# EAGLE design PetitCool_InternalShield (EAGLE 7.3.0)
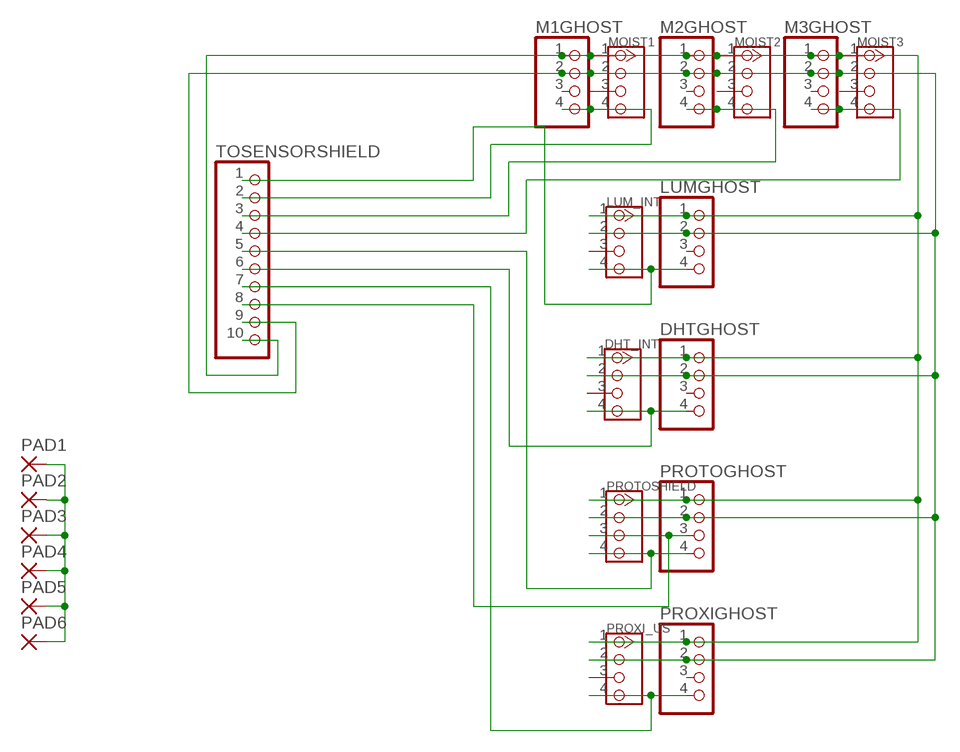
[diagram p0: schematic, sheet 1]

## Parts
DHT_INT  TWIG-4P-2.0-2.0  [4P-2.0]
DHTGHOST  PINHD-1X4  [1X04]
LUM_INT  TWIG-4P-2.0-2.0  [4P-2.0]
LUMGHOST  PINHD-1X4  [1X04]
M1GHOST  PINHD-1X4  [1X04]
M2GHOST  PINHD-1X4  [1X04]
M3GHOST  PINHD-1X4  [1X04]
MOIST1  TWIG-4P-2.0-2.0  [4P-2.0]
MOIST2  TWIG-4P-2.0-2.0  [4P-2.0]
MOIST3  TWIG-4P-2.0-2.0  [4P-2.0]
PAD1  2,15/1,0  [2,15/1,0]
PAD2  2,15/1,0  [2,15/1,0]
PAD3  2,15/1,0  [2,15/1,0]
PAD4  2,15/1,0  [2,15/1,0]
PAD5  2,15/1,0  [2,15/1,0]
PAD6  2,15/1,0  [2,15/1,0]
PROTOGHOST  PINHD-1X4  [1X04]
PROTOSHIELD  TWIG-4P-2.0-2.0  [4P-2.0]
PROXI_US  TWIG-4P-2.0-2.0  [4P-2.0]
PROXIGHOST  PINHD-1X4  [1X04]
TOSENSORSHIELD  PINHD-1X10  [1X10]

## Nets
+5V: DHT_INT.2 DHTGHOST.2 LUM_INT.2 LUMGHOST.2 M1GHOST.2 M2GHOST.2 M3GHOST.2 MOIST1.2 MOIST2.2 MOIST3.2 PROTOGHOST.2 PROTOSHIELD.2 PROXI_US.2 PROXIGHOST.2 TOSENSORSHIELD.9
DHT_INT(D36): DHT_INT.4 DHTGHOST.4 TOSENSORSHIELD.6
GND_5V: DHT_INT.1 DHTGHOST.1 LUM_INT.1 LUMGHOST.1 M1GHOST.1 M2GHOST.1 M3GHOST.1 MOIST1.1 MOIST2.1 MOIST3.1 PAD1.1(P) PAD2.1(P) PAD3.1(P) PAD4.1(P) PAD5.1(P) PAD6.1(P) PROTOGHOST.1 PROTOSHIELD.1 PROXI_US.1 PROXIGHOST.1 TOSENSORSHIELD.10
LUM_INT(A10): LUM_INT.4 LUMGHOST.4 TOSENSORSHIELD.1
MOIST1(A11): M1GHOST.4 MOIST1.4 TOSENSORSHIELD.2
MOIST2(A12): M2GHOST.4 MOIST2.4 TOSENSORSHIELD.3
MOIST3(A13): M3GHOST.4 MOIST3.4 TOSENSORSHIELD.4
PROTO(A14): PROTOGHOST.4 PROTOSHIELD.4 TOSENSORSHIELD.5
PROTO(D44): PROTOGHOST.3 PROTOSHIELD.3 TOSENSORSHIELD.8
PROXI_US(D38): PROXI_US.4 PROXIGHOST.4 TOSENSORSHIELD.7
Unconnected: DHT_INT.3 DHTGHOST.3 LUM_INT.3 LUMGHOST.3 M1GHOST.3 M2GHOST.3 M3GHOST.3 MOIST1.3 MOIST2.3 MOIST3.3 PROXI_US.3 PROXIGHOST.3

## Library data of the parts
DHT_INT LUM_INT MOIST1-MOIST3 PROTOSHIELD PROXI_US = Connector:TWIG-4P-2.0
DHTGHOST LUMGHOST M1GHOST M2GHOST M3GHOST PROTOGHOST PROXIGHOST = pinhead:PINHD-1X4: PIN HEADER
PAD1-PAD6 = wirepad:2,15/1,0: THROUGH-HOLE PAD
TOSENSORSHIELD = pinhead:PINHD-1X10: PIN HEADER

## Board
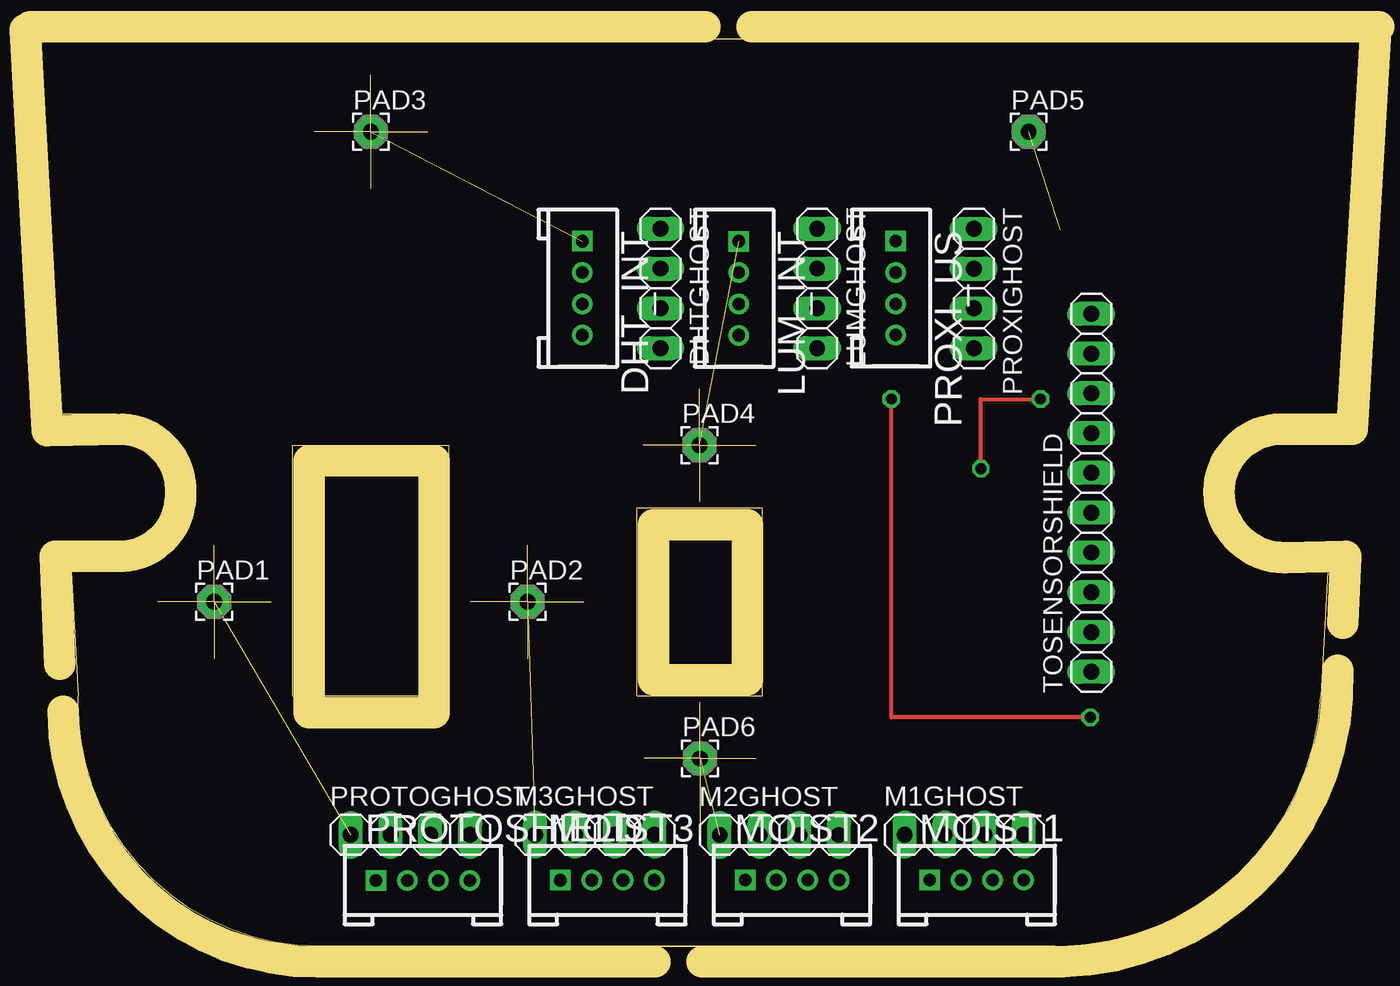
[diagram p1: board, top side]
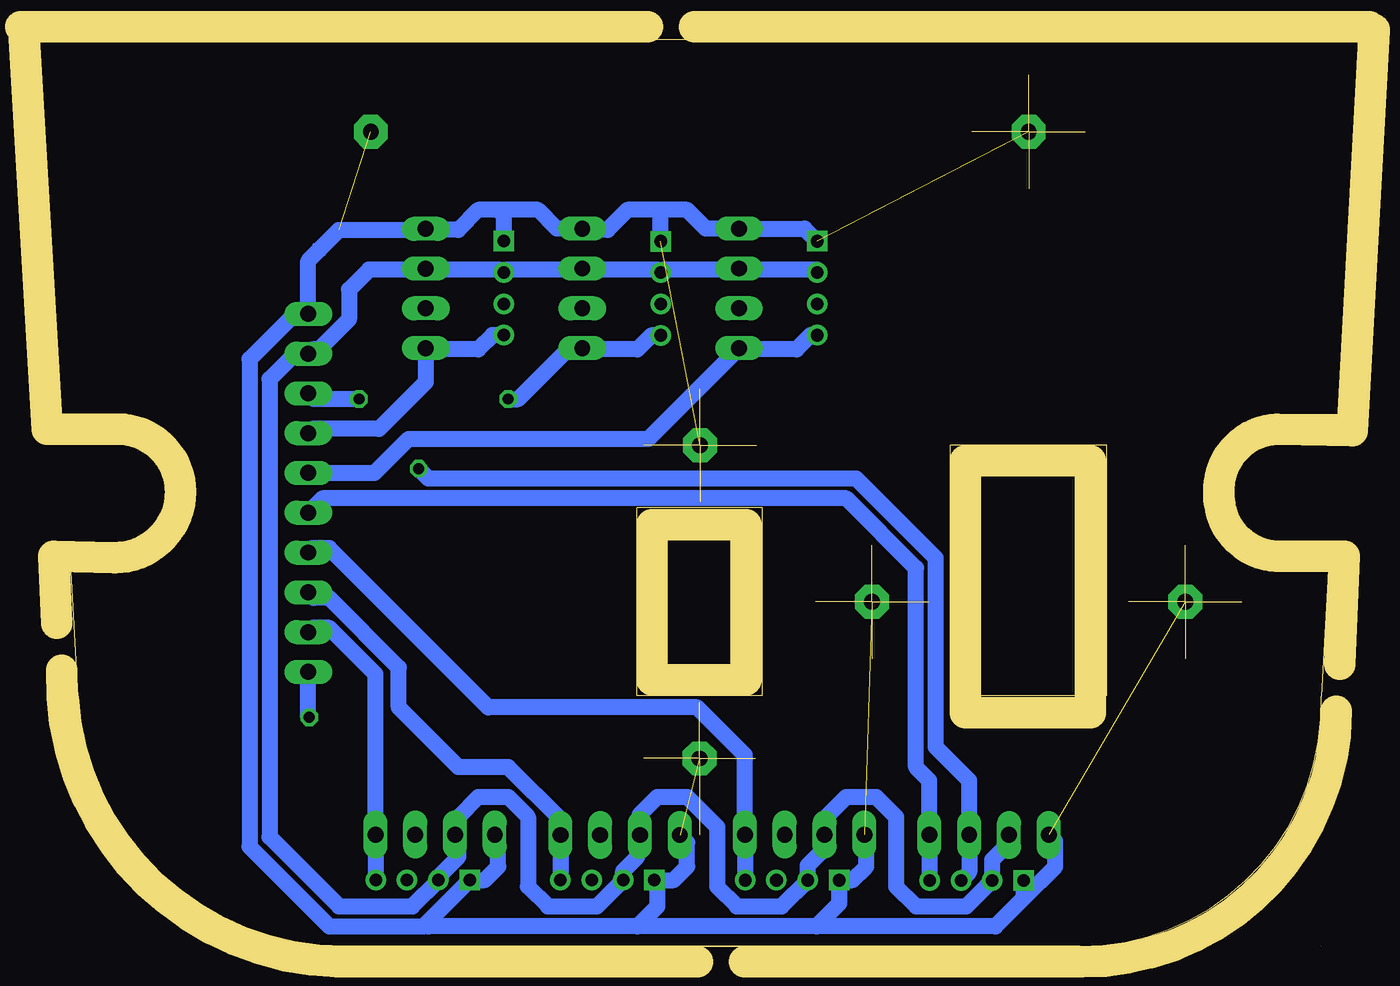
[diagram p2: board, bottom side, seen from below]

Size 84.35 x 57.91 mm. Coordinates in mm from the lower left corner, seen from the top.
Outline: 4.95,23.96 arc180 4.95,33.96
Outline: 79.4,33.96 arc180 79.4,23.96 82.32,23.96 81.85,15.99
Outline: 2.51,0 2.51,0
Outline: 2.51,15.99 arc92 17.91,0.01 64.86,0 19.5,0
Outline: 17.9,0.01 64.86,0 arc87 81.84,15.99
Outline: 2.51,15.99 2.03,23.96 4.95,23.96
Outline: 4.95,33.96 1.43,33.96 0,57.91 84.36,57.91 82.92,33.96 79.4,33.96
Outline: 11.18,22 11.18,25.63
Outline: 11.18,22 7.55,22
Outline: 11.18,22 11.18,18.38
Outline: 11.18,22 14.8,22
Outline: 31.18,22 31.18,25.63
Outline: 31.18,22 27.55,22
Outline: 31.18,22 31.18,18.38
Outline: 31.18,22 34.8,22
Outline: 42.17,32 42.17,35.6
Outline: 42.17,32 38.57,32
Outline: 42.17,32 42.17,28.4
Outline: 42.17,32 45.77,32
Outline: 42.19,12 42.19,15.58
Outline: 42.19,12 38.6,12
Outline: 42.19,12 42.19,7.15
Outline: 42.19,12 45.77,12
Outline: 21.18,52 21.18,55.63
Outline: 21.18,52 17.55,52
Outline: 21.18,52 21.18,48.38
Outline: 21.18,52 24.8,52
Outline: 38.18,28 46.18,28 46.18,16 38.18,16 38.18,28
Outline: 16.18,32 26.18,32 26.18,16 16.18,16 16.18,32
Copper layers (1*16): Top 0.035mm / dielectric 1.5mm / Bottom 0.035mm
Design rules "default": minimum track width 10mil, minimum drill 24mil, track to track 8mil, track to pad 8mil, pad to pad 8mil, via to via 8mil, smd to smd 8mil, copper to edge 40mil, drill to drill 8mil, minimum pad ring 10mil, minimum via ring 8mil, stop-mask expansion 4mil, vias tented up to drill 0mil, thermal gap 10mil
Milling: 26 lines

### Footprints (pad centres in the part's own frame; a part is rotated, then mirrored left to right if it is on the bottom)
4P-2.0 = drill 0.8 pad 1.27 square: 1 -3,0 | drill 0.8 pad 1.27: 2 -1,0; 3 1,0; 4 3,0
1X04 = drill 1.016 long: 1 -3.81,0; 2 -1.27,0; 3 1.27,0; 4 3.81,0
2,15/1,0 = drill 1.016 pad 2.159 octagon: 1 0,0
1X10 = drill 1.016 long: 1 -11.43,0; 2 -8.89,0; 3 -6.35,0; 4 -3.81,0; 5 -1.27,0; 6 1.27,0; 7 3.81,0; 8 6.35,0; 9 8.89,0; 10 11.43,0

### Placement (x,y rotation side)
DHT_INT  34.68,42.01 270 top
DHTGHOST  39.68,42 270 top
LUM_INT  44.67,42.01 270 top
LUMGHOST  49.68,42 270 top
M1GHOST  59.07,7.14 0 top
M2GHOST  47.26,7.11 0 top
M3GHOST  35.48,7.14 0 top
MOIST1  59.87,4.23 0 top
MOIST2  48.07,4.23 0 top
MOIST3  36.28,4.23 0 top
PAD1  11.18,22 0 top
PAD2  31.18,22 0 top
PAD3  21.18,52 0 top
PAD4  42.17,32 0 top
PAD5  63.18,52 0 top
PAD6  42.19,12 0 top
PROTOGHOST  23.71,7.13 0 top
PROTOSHIELD  24.5,4.22 0 top
PROXI_US  54.68,42.02 270 top
PROXIGHOST  59.68,42 270 top
TOSENSORSHIELD  67.18,28.95 90 top

### Tracks (layer width: path | path; a pad name or v marks a point on that pad's centre or on a via)
+5V
  Bottom 0.254: LUM_INT.2 44.7,43.01 | PROXI_US.2 54.87,43.02
  Bottom 1.016: DHT_INT.2 34.68,43.15 34.73,43.2 39.75,43.2 DHTGHOST.2 39.88,43.27 39.81,43.2 44.49,43.2 LUM_INT.2 | 44.7,43.01 44.89,43.2 49.75,43.2 LUMGHOST.2 50.04,43.27 49.97,43.2 54.5,43.2 PROXI_US.2 | 54.87,43.02 55.05,43.2 59.75,43.2 PROXIGHOST.2 60.2,43.27 60.13,43.2 63.3,43.2 64.57,41.93 64.57,40.02 66.48,38.12 66.9,38.12 TOSENSORSHIELD.9 68.02,37.84 69.65,36.21 69.65,7 65.21,2.56 60.54,2.56 MOIST1.2 58.87,4.45 57.59,5.73 57.59,6.92 | PROTOGHOST.2 22.66,6.9 22.66,6.37 23.5,5.53 PROTOSHIELD.2 25.16,2.56 28.38,2.56 29.65,3.83 29.65,8.27 30.92,9.54 32.82,9.54 34.09,8.27 34.09,7.02 | 34.09,7.02 34.09,6.37 35.28,5.18 MOIST3.2 36.95,2.56 39.81,2.56 41.08,3.83 41.08,7.64 42.98,9.54 44.89,9.54 45.99,8.44 M2GHOST.2 46.16,6.95 46.16,5.73 47.07,4.82 MOIST2.2 48.74,2.56 51.87,2.56 53.14,3.83 53.14,8.27 54.41,9.54 56.32,9.54 57.59,8.27 57.59,6.92 | 34.09,7.02 M3GHOST.2 | 57.59,6.92 M1GHOST.2
DHT_INT(D36)
  Bottom 1.016: DHT_INT.4 35.1,39.01 36,38.12 39.6,38.12 DHTGHOST.4 45.46,32.4 60.76,32.4 62.94,30.22 TOSENSORSHIELD.6
GND_5V  (6 unrouted)
  Bottom 0.254: 66.79,44.79 66.48,44.47
  Bottom 1.016: 44.89,47.01 42.98,47.01 41.78,45.81 DHTGHOST.1 35.48,45.81 DHT_INT.1 | 44.89,47.01 46.79,47.01 48.06,45.74 49.61,45.74 LUMGHOST.1 51.31,45.81 52.51,47.01 55.05,47.01 | 55.05,47.01 56.32,47.01 57.59,45.74 59.61,45.74 PROXIGHOST.1 59.75,45.74 65.21,45.74 66.48,44.47 67.18,43.77 TOSENSORSHIELD.10 68.02,40.38 70.92,37.48 70.92,6.37 65.84,1.29 59.81,1.29 59.65,1.45 | LUM_INT.1 44.67,46.8 44.89,47.01 | PROXI_US.1 54.68,46.65 55.05,47.01 | 21.5,3.08 19.49,5.1 19.49,6.72 PROTOGHOST.1 | M3GHOST.1 31.55,7.02 31.55,5.1 32.42,4.23 MOIST3.1 33.28,2.73 34.73,1.29 | M2GHOST.1 42.98,6.64 42.98,5.1 43.85,4.23 MOIST2.1 44.89,4.05 44.89,2.56 46.16,1.29 | M1GHOST.1 55.05,6.92 55.05,5.1 55.91,4.23 MOIST1.1 59.65,1.45 | PROTOSHIELD.1 21.5,3.08 | 21.5,3.08 23.3,1.29 34.73,1.29 | 59.65,1.45 59.49,1.29 46.16,1.29 | 34.73,1.29 46.16,1.29
LUM_INT(A10)  (via drill 0.7)
  Top 0.254: v67.11,14.62 54.41,14.62 v54.41,34.94
  Bottom 1.016: LUM_INT.4 45.26,39.01 46.16,38.12 49.61,38.12 LUMGHOST.4 49.75,38.12 50.6,38.12 53.78,34.94 v54.41,34.94 | v67.11,14.62 67.18,14.62 TOSENSORSHIELD.1
MOIST1(A11)
  Bottom 1.016: MOIST1.4 62.88,4.25 M1GHOST.4 62.88,17.38 65.84,20.34 66.9,20.34 TOSENSORSHIELD.2
MOIST2(A12)
  Bottom 1.016: MOIST2.4 M2GHOST.4 51.07,8.11 54.41,11.45 57.59,11.45 61.4,15.26 61.4,17.8 65.84,22.24 66.82,22.24 TOSENSORSHIELD.3
MOIST3(A13)
  Bottom 1.016: MOIST3.4 39.29,4.24 M3GHOST.4 39.29,12.21 42.35,15.26 55.68,15.26 65.84,25.42 66.9,25.42 TOSENSORSHIELD.4
PROTO(A14)
  Bottom 1.016: PROTOSHIELD.4 27.52,4.24 PROTOGHOST.4 27.52,10.59 28.38,11.45 28.38,24.15 32.82,28.59 66.27,28.59 TOSENSORSHIELD.5
PROTO(D44)  (via drill 0.7)
  Top 0.254: v60.13,30.5 60.13,34.94 v63.94,34.94
  Bottom 1.016: PROTOSHIELD.3 24.98,4.75 PROTOGHOST.3 24.98,10.59 27.11,12.72 27.11,24.78 32.19,29.86 59.49,29.86 v60.13,30.5 | v63.94,34.94 66.82,34.94 TOSENSORSHIELD.8
PROXI_US(D38)
  Bottom 1.016: PROXI_US.4 55.42,39.02 56.32,38.12 59.61,38.12 PROXIGHOST.4 59.68,36.03 62.67,33.04 66.9,33.04 TOSENSORSHIELD.7